# EasyEDA schematic kasianov_repiter_a.json
TITLE: Sheet_1; REV: 1.0; Date: 2023-03-16; Sheet: 1/1; Company: Your Company
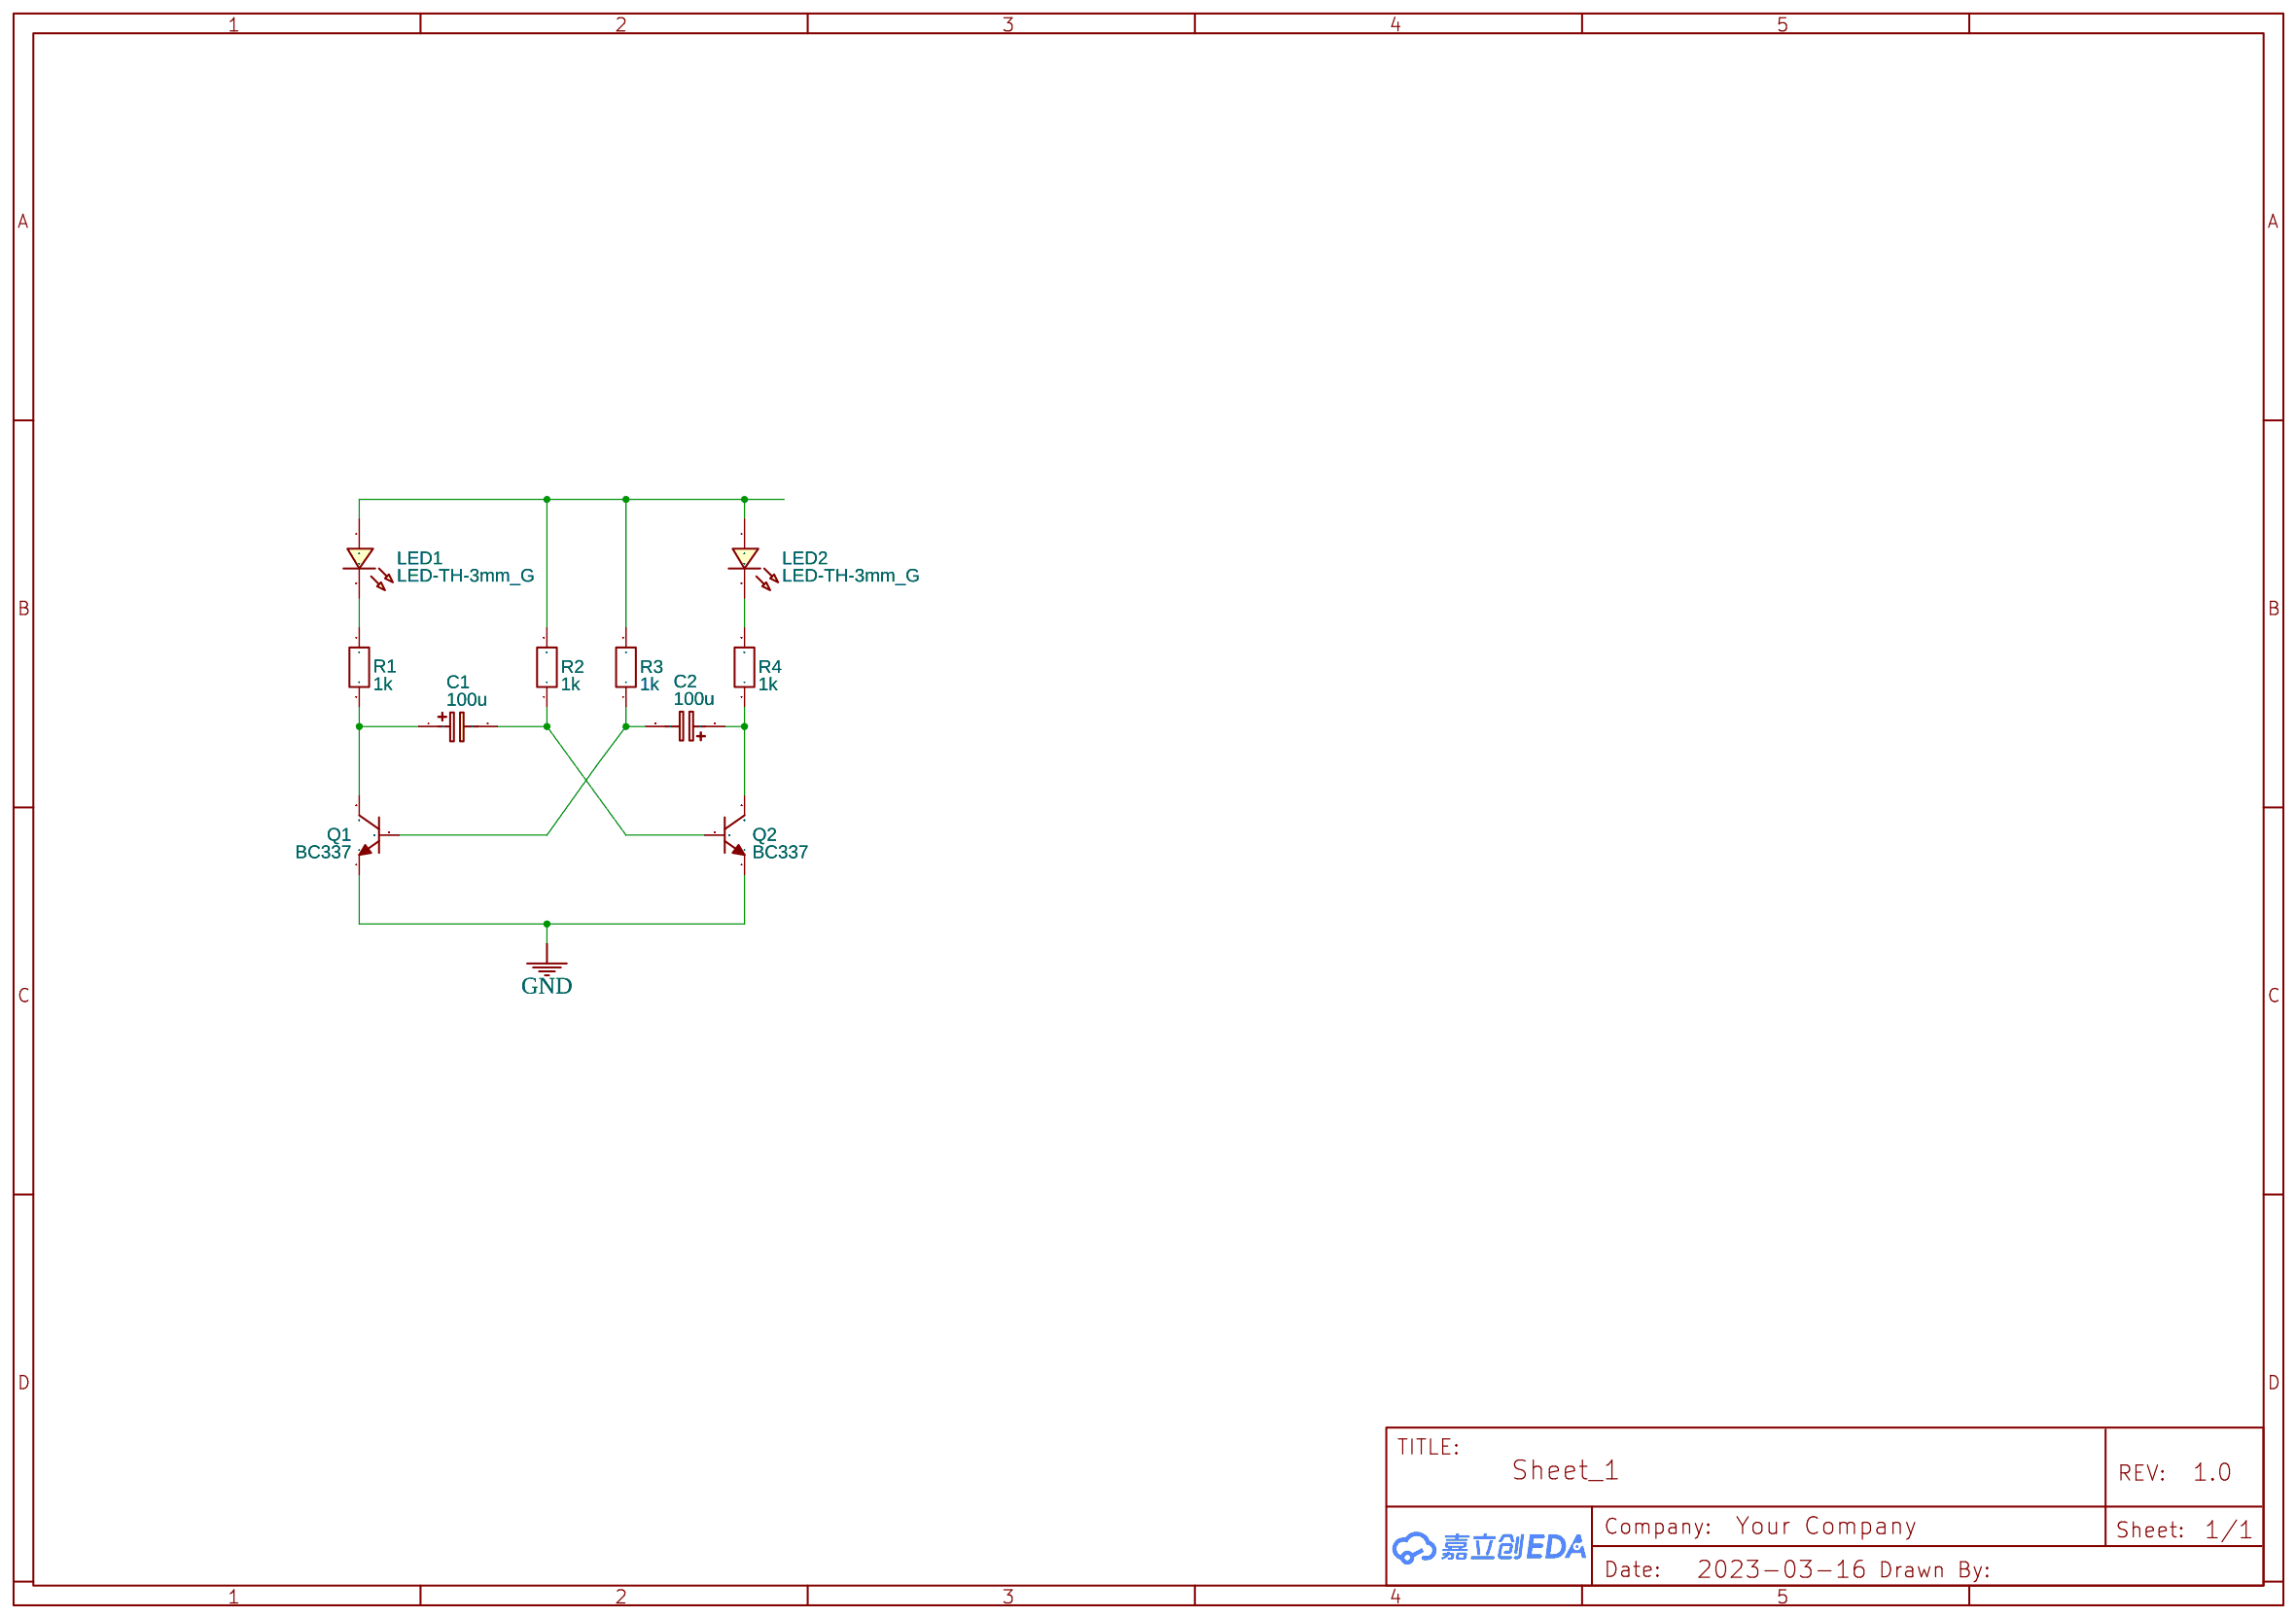
[diagram p0: schematic sheet]

## Parts
C1  100u  [CASE-A_3216]
C2  100u  [CASE-A_3216]
LED1  LED-TH-3mm_G  [LED-TH_BD3.0_GREEN]
LED2  LED-TH-3mm_G  [LED-TH_BD3.0_GREEN]
Q1  BC337  [TO-92-3_L5.1-W4.1-P1.27-L]
Q2  BC337  [TO-92-3_L5.1-W4.1-P1.27-L]
R1  1k  [R0603]
R2  1k  [R0603]
R3  1k  [R0603]
R4  1k  [R0603]

## Library data of the parts
C1 C2 = C_Tan_SMD_A_EU: Contributor: LCEDA_Lib
LED1 LED2 = LED-TH-3mm_G: Manufacturer: EVERLIGHT(台湾亿光); Manufacturer Part: 204-10SYGD/S530-E3; Supplier Part: C85161; Contributor: LCEDA_Lib
Q1 Q2 = 2N3904(TO-92): Supplier: LCSC; Manufacturer: SEMTECH; Manufacturer Part: 2N3904; Supplier Part: C118538; Contributor: LCEDA_Lib
R1-R4 = R_0603_EU: Contributor: LCEDA_Lib

## Nets
GND: Q1.1(E) Q2.1(E)
Net-(C1-1): C1.1 Q1.3(C) R1.2
Net-(C1-2): C1.2 Q2.2(B) R2.1
Net-(C2-1): C2.1 Q2.3(C) R4.1
Net-(C2-2): C2.2 Q1.2(B) R3.1
Net-(LED1-1): LED1.1 LED2.1 R2.2 R3.2
Net-(LED1-2): LED1.2 R1.1
Net-(LED2-2): LED2.2 R4.2
